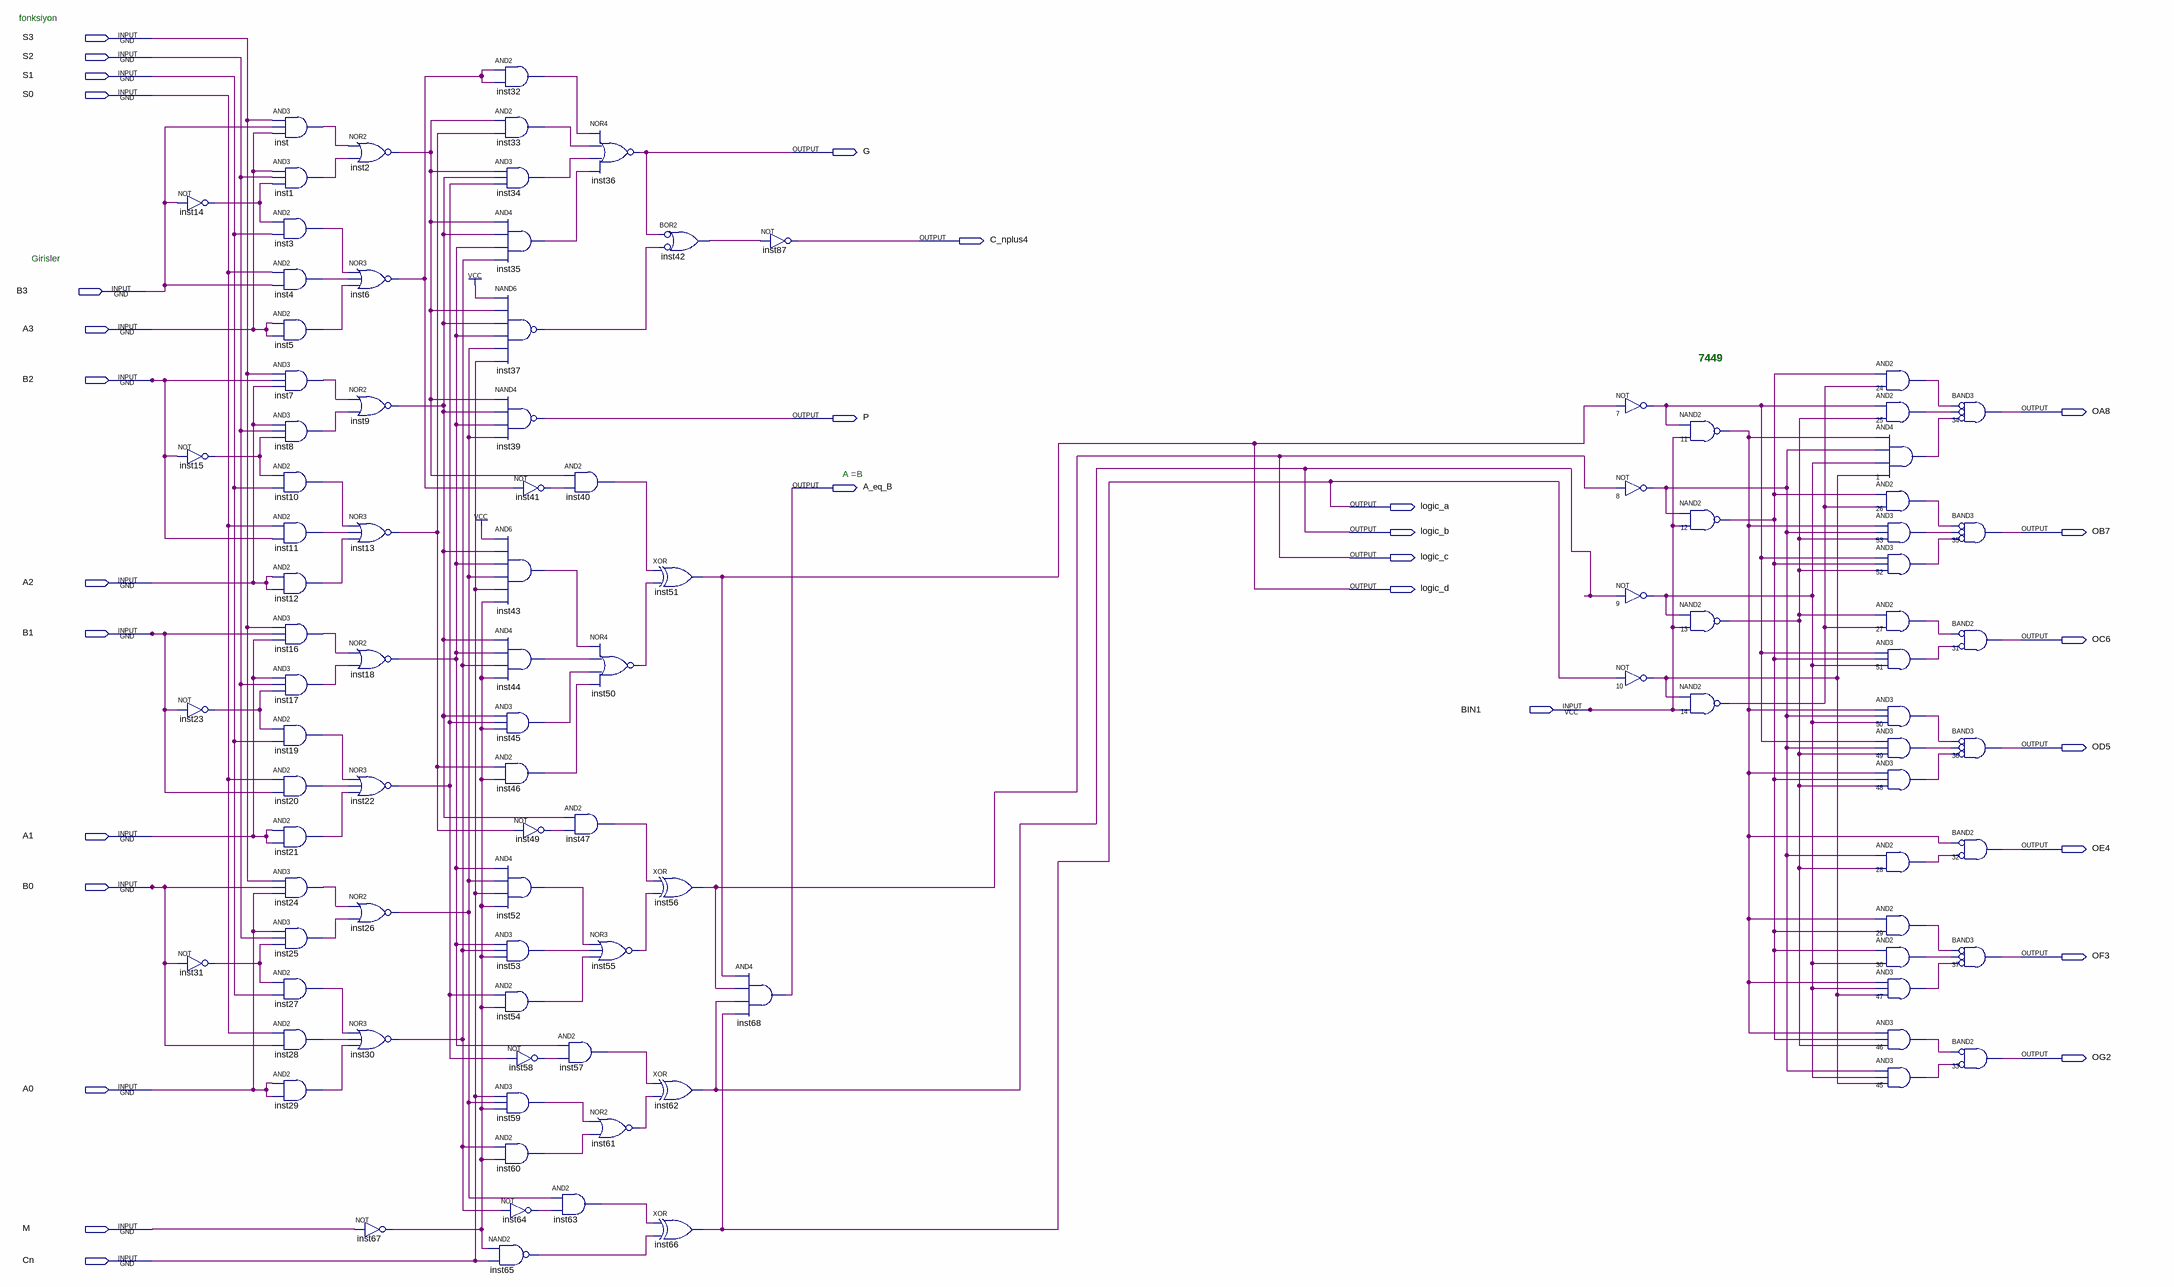
[diagram p0: schematic sheet]
// Quartus schematic 74181-alu.bdf as structural Verilog: 100 symbols, 30 pins
module \74181-alu  (
  input  S3,
  input  S2,
  input  S1,
  input  S0,
  input  B3,
  input  A3,
  input  B2,
  input  A2,
  input  B1,
  input  BIN1,
  input  A1,
  input  B0,
  input  A0,
  input  M,
  input  Cn,
  output G,
  output C_nplus4,
  output OA8,
  output P,
  output A_eq_B,
  output logic_a,
  output logic_b,
  output OB7,
  output logic_c,
  output logic_d,
  output OC6,
  output OD5,
  output OE4,
  output OF3,
  output OG2
);

  wire inst1_out, inst2_out, inst3_out, inst4_out, inst5_out, inst6_out, inst7_out, inst8_out, inst9_out,
       inst10_out, inst11_out, inst12_out, inst13_out, inst14_out, inst15_out, inst16_out, inst17_out,
       inst18_out, inst19_out, inst20_out, inst21_out, inst22_out, inst23_out, inst24_out, inst25_out,
       inst26_out, inst27_out, inst28_out, inst29_out, inst30_out, inst31_out, inst32_out, inst33_out,
       inst34_out, inst35_out, inst37_out, inst40_out, inst41_out, inst42_out, inst43_out, inst44_out,
       inst45_out, inst46_out, inst47_out, inst49_out, inst50_out, inst52_out, inst53_out, inst54_out,
       inst55_out, inst57_out, inst58_out, inst59_out, inst60_out, inst61_out, inst63_out, inst64_out,
       inst65_out, inst67_out, inst_out, n1_out, n7_out, n8_out, n9_out, n10_out, n11_out, n12_out, n13_out,
       n14_out, n24_out, n25_out, n26_out, n27_out, n28_out, n29_out, n30_out, n45_out, n46_out, n47_out,
       n48_out, n49_out, n50_out, n51_out, n52_out, n53_out;

  not inst14 (inst14_out, B3);
  not inst15 (inst15_out, B2);
  not inst23 (inst23_out, B1);
  not inst31 (inst31_out, B0);
  and inst (inst_out, S3, B3, A3);
  and inst1 (inst1_out, A3, S2, inst14_out);
  and inst3 (inst3_out, inst14_out, S1);
  and inst4 (inst4_out, S0, B3);
  and inst5 (inst5_out, A3, A3);
  and inst7 (inst7_out, S3, B2, A2);
  and inst8 (inst8_out, A2, S2, inst15_out);
  and inst10 (inst10_out, inst15_out, S1);
  and inst11 (inst11_out, S0, B2);
  and inst12 (inst12_out, A2, A2);
  and inst16 (inst16_out, S3, B1, A1);
  and inst17 (inst17_out, A1, S2, inst23_out);
  and inst19 (inst19_out, inst23_out, S1);
  and inst20 (inst20_out, S0, B1);
  and inst21 (inst21_out, A1, A1);
  and inst24 (inst24_out, S3, B0, A0);
  and inst25 (inst25_out, A0, S2, inst31_out);
  and inst27 (inst27_out, inst31_out, S1);
  and inst28 (inst28_out, S0, B0);
  and inst29 (inst29_out, A0, A0);
  nor inst2 (inst2_out, inst_out, inst1_out);
  nor inst6 (inst6_out, inst3_out, inst4_out, inst5_out);
  nor inst9 (inst9_out, inst7_out, inst8_out);
  nor inst13 (inst13_out, inst10_out, inst11_out, inst12_out);
  nor inst18 (inst18_out, inst16_out, inst17_out);
  nor inst22 (inst22_out, inst19_out, inst20_out, inst21_out);
  nor inst26 (inst26_out, inst24_out, inst25_out);
  nor inst30 (inst30_out, inst27_out, inst28_out, inst29_out);
  not inst67 (inst67_out, M);
  and inst32 (inst32_out, inst6_out, inst6_out);
  and inst33 (inst33_out, inst2_out, inst13_out);
  and inst34 (inst34_out, inst2_out, inst9_out, inst22_out);
  and inst35 (inst35_out, inst2_out, inst9_out, inst18_out, inst30_out);
  nand inst37 (inst37_out, 1'b1, inst2_out, inst9_out, inst18_out, inst26_out, Cn);
  nand inst39 (P, inst2_out, inst9_out, inst18_out, inst26_out);
  and inst43 (inst43_out, 1'b1, inst9_out, inst18_out, inst26_out, Cn, inst67_out);
  and inst44 (inst44_out, inst9_out, inst18_out, inst30_out, inst67_out);
  and inst45 (inst45_out, inst9_out, inst22_out, inst67_out);
  and inst46 (inst46_out, inst13_out, inst67_out);
  and inst52 (inst52_out, inst18_out, inst26_out, Cn, inst67_out);
  and inst53 (inst53_out, inst18_out, inst30_out, inst67_out);
  and inst54 (inst54_out, inst22_out, inst67_out);
  and inst59 (inst59_out, Cn, inst26_out, inst67_out);
  and inst60 (inst60_out, inst30_out, inst67_out);
  not inst64 (inst64_out, inst30_out);
  nand inst65 (inst65_out, inst67_out, Cn);
  not inst41 (inst41_out, inst6_out);
  not inst49 (inst49_out, inst13_out);
  not inst58 (inst58_out, inst22_out);
  and inst63 (inst63_out, inst26_out, inst64_out);
  nor inst36 (G, inst32_out, inst33_out, inst34_out, inst35_out);
  and inst40 (inst40_out, inst2_out, inst41_out);
  nor inst50 (inst50_out, inst43_out, inst44_out, inst45_out, inst46_out);
  and inst47 (inst47_out, inst9_out, inst49_out);
  nor inst55 (inst55_out, inst52_out, inst53_out, inst54_out);
  and inst57 (inst57_out, inst18_out, inst58_out);
  nor inst61 (inst61_out, inst59_out, inst60_out);
  xor inst51 (logic_d, inst40_out, inst50_out);
  xor inst56 (logic_c, inst47_out, inst55_out);
  xor inst62 (logic_b, inst57_out, inst61_out);
  xor inst66 (logic_a, inst63_out, inst65_out);
  or inst42 (inst42_out, ~G, ~inst37_out);  // BOR2
  and inst68 (A_eq_B, logic_d, logic_c, logic_b, logic_a);
  not inst87 (C_nplus4, inst42_out);
  not u_7 (n7_out, logic_d);
  not u_8 (n8_out, logic_c);
  not u_9 (n9_out, logic_b);
  not u_10 (n10_out, logic_a);
  nand u_11 (n11_out, n7_out, BIN1);
  nand u_12 (n12_out, n8_out, BIN1);
  nand u_13 (n13_out, n9_out, BIN1);
  nand u_14 (n14_out, n10_out, BIN1);
  and u_24 (n24_out, n12_out, n14_out);
  and u_25 (n25_out, n7_out, n13_out);
  and u_1 (n1_out, n11_out, n8_out, n9_out, n10_out);
  and u_26 (n26_out, n12_out, n14_out);
  and u_53 (n53_out, n11_out, n8_out, n13_out);
  and u_52 (n52_out, n7_out, n12_out, n13_out);
  and u_27 (n27_out, n13_out, n14_out);
  and u_51 (n51_out, n7_out, n12_out, n9_out);
  and u_50 (n50_out, n11_out, n8_out, n9_out);
  and u_49 (n49_out, n7_out, n8_out, n13_out);
  and u_48 (n48_out, n11_out, n12_out, n13_out);
  and u_28 (n28_out, n8_out, n13_out);
  and u_29 (n29_out, n11_out, n12_out);
  and u_30 (n30_out, n12_out, n9_out);
  and u_47 (n47_out, n11_out, n9_out, n10_out);
  and u_46 (n46_out, n11_out, n12_out, n13_out);
  and u_45 (n45_out, n8_out, n9_out, n10_out);
  and u_34 (OA8, ~n24_out, ~n25_out, ~n1_out);  // BAND3
  and u_35 (OB7, ~n26_out, ~n53_out, ~n52_out);  // BAND3
  and u_31 (OC6, ~n27_out, ~n51_out);  // BAND2
  and u_36 (OD5, ~n50_out, ~n49_out, ~n48_out);  // BAND3
  and u_32 (OE4, ~n11_out, ~n28_out);  // BAND2
  and u_37 (OF3, ~n29_out, ~n30_out, ~n47_out);  // BAND3
  and u_33 (OG2, ~n46_out, ~n45_out);  // BAND2

  // Notes on the sheet:
  //   fonksiyon
  //   Girisler
  //   7449
  //   A =B
endmodule
